# EAGLE schematic ElectronicATU (EAGLE 7.7.0)
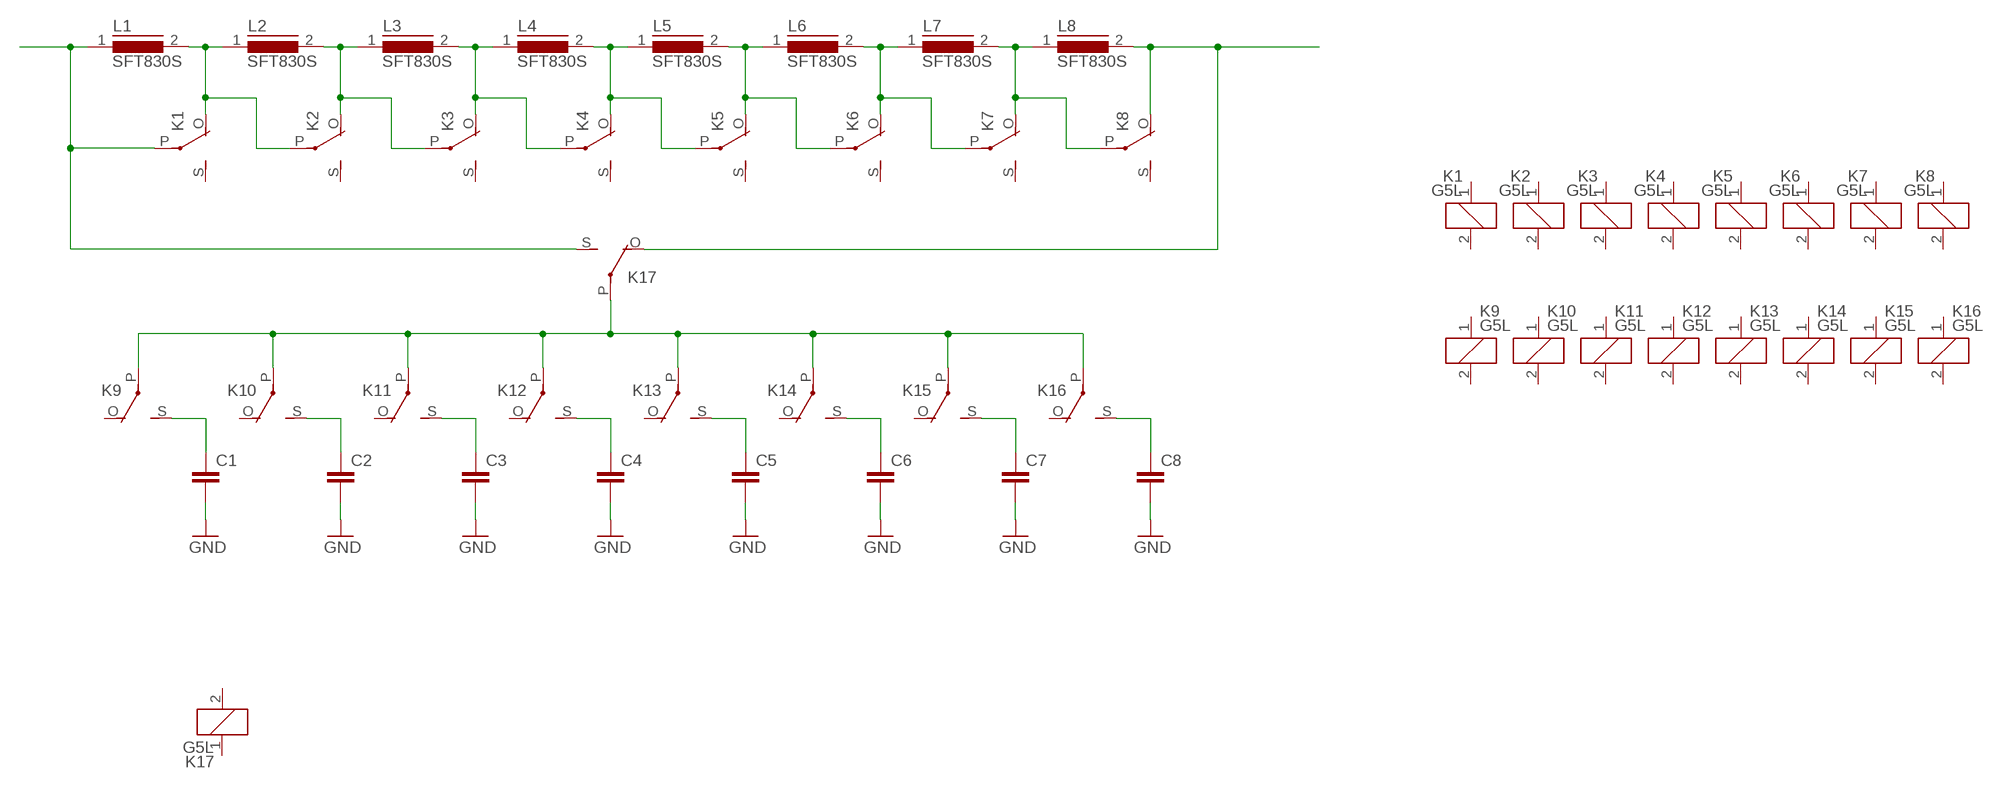
[diagram p0: schematic, sheet 1]

## Parts
C1  C-EU075-042X103  [C075-042X103]
C2  C-EU075-042X103  [C075-042X103]
C3  C-EU075-042X103  [C075-042X103]
C4  C-EU075-042X103  [C075-042X103]
C5  C-EU075-042X103  [C075-042X103]
C6  C-EU075-042X103  [C075-042X103]
C7  C-EU075-042X103  [C075-042X103]
C8  C-EU075-042X103  [C075-042X103]
K1  G5L  [G5LE]
K2  G5L  [G5LE]
K3  G5L  [G5LE]
K4  G5L  [G5LE]
K5  G5L  [G5LE]
K6  G5L  [G5LE]
K7  G5L  [G5LE]
K8  G5L  [G5LE]
K9  G5L  [G5LE]
K10  G5L  [G5LE]
K11  G5L  [G5LE]
K12  G5L  [G5LE]
K13  G5L  [G5LE]
K14  G5L  [G5LE]
K15  G5L  [G5LE]
K16  G5L  [G5LE]
K17  G5L  [G5LE]
L1  SFT830S  [SFT830S]
L2  SFT830S  [SFT830S]
L3  SFT830S  [SFT830S]
L4  SFT830S  [SFT830S]
L5  SFT830S  [SFT830S]
L6  SFT830S  [SFT830S]
L7  SFT830S  [SFT830S]
L8  SFT830S  [SFT830S]

## Nets
GND: C1.2 C2.2 C3.2 C4.2 C5.2 C6.2 C7.2 C8.2
N$1: K1.P(2:P) K17.S(2:S) L1.1
N$2: K1.O(2:O) K2.P(2:P) L1.2 L2.1
N$3: K2.O(2:O) K3.P(2:P) L2.2 L3.1
N$4: K3.O(2:O) K4.P(2:P) L3.2 L4.1
N$5: K4.O(2:O) K5.P(2:P) L4.2 L5.1
N$6: K5.O(2:O) K6.P(2:P) L5.2 L6.1
N$7: K6.O(2:O) K7.P(2:P) L6.2 L7.1
N$8: K7.O(2:O) K8.P(2:P) L7.2 L8.1
N$9: K8.O(2:O) K17.O(2:O) L8.2
N$10: C1.1 K9.S(2:S)
N$11: C2.1 K10.S(2:S)
N$12: C3.1 K11.S(2:S)
N$13: C4.1 K12.S(2:S)
N$14: C5.1 K13.S(2:S)
N$15: C6.1 K14.S(2:S)
N$16: C7.1 K15.S(2:S)
N$17: C8.1 K16.S(2:S)
N$18: K9.P(2:P) K10.P(2:P) K11.P(2:P) K12.P(2:P) K13.P(2:P) K14.P(2:P) K15.P(2:P) K16.P(2:P) K17.P(2:P)
Unconnected: K1.1 K1.2 K1.S(2:S) K2.1 K2.2 K2.S(2:S) K3.1 K3.2 K3.S(2:S) K4.1 K4.2 K4.S(2:S) K5.1 K5.2 K5.S(2:S) K6.1 K6.2 K6.S(2:S) K7.1 K7.2 K7.S(2:S) K8.1 K8.2 K8.S(2:S) K9.1 K9.2 K9.O(2:O) K10.1 K10.2 K10.O(2:O) K11.1 K11.2 K11.O(2:O) K12.1 K12.2 K12.O(2:O) K13.1 K13.2 K13.O(2:O) K14.1 K14.2 K14.O(2:O) K15.1 K15.2 K15.O(2:O) K16.1 K16.2 K16.O(2:O) K17.1 K17.2

## Library data of the parts
C1-C8 = rcl:C-EU: CAPACITOR, European symbol
K1-K17 = relay:G5L: RELAY 1 x switch, 10 A/120 V AC, 8 A/30 V ADC, Omron; OC_FARNELL: unknown; OC_NEWARK: unknown
L1-L8 = inductors:SFT830S: INDUCTOR